# EAGLE design murdock_conn_v4 (EAGLE 6.4)
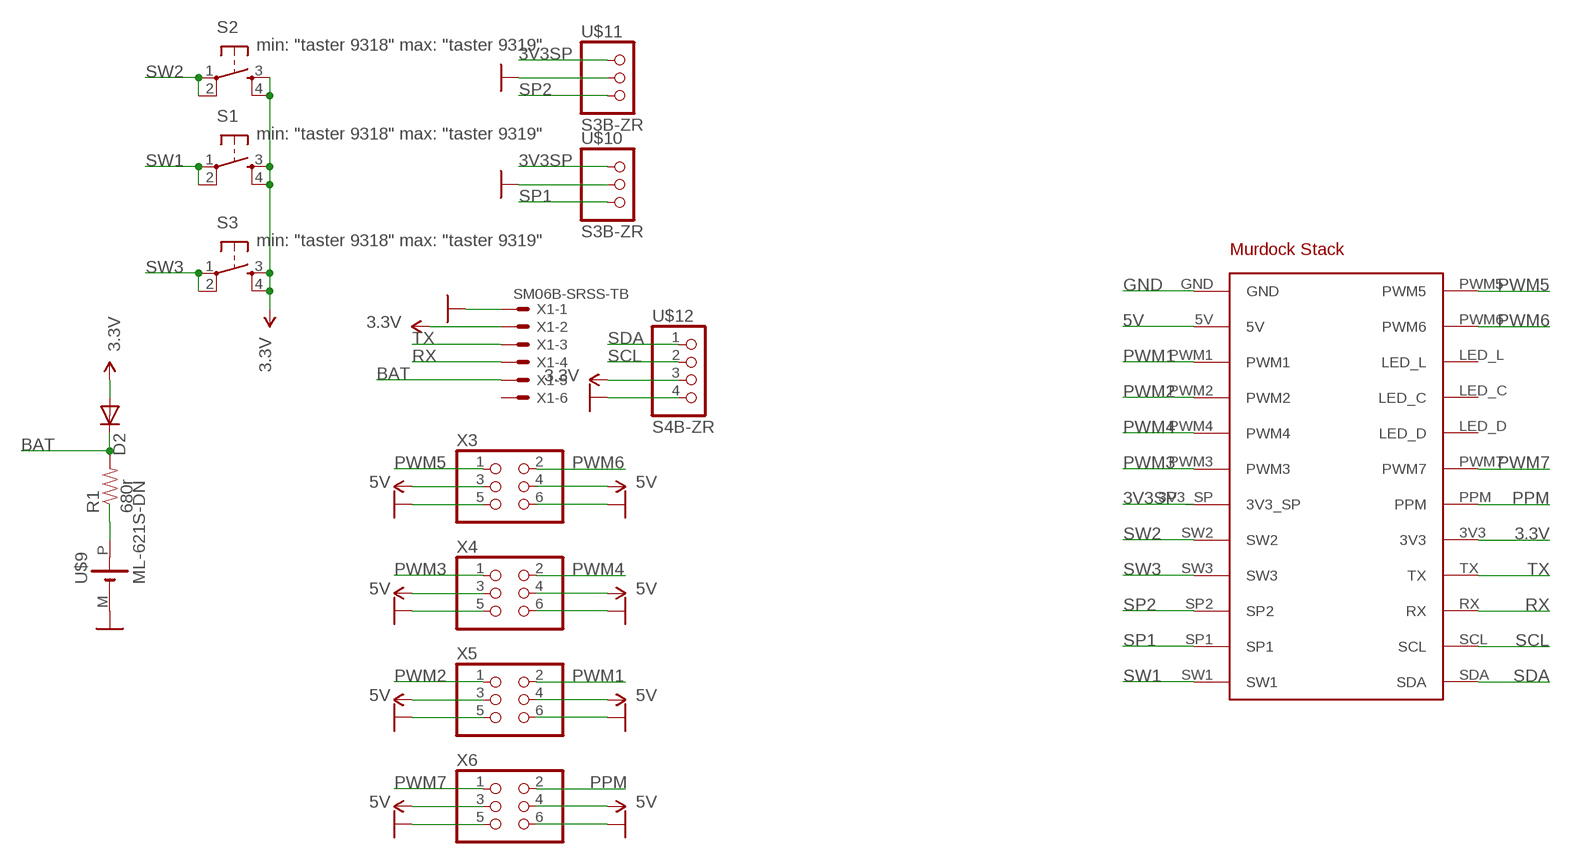
[diagram p0: schematic, sheet 1]

## Parts
D2  DIODE-SOD323-R  [SOD323-R]
R1  680r  RESISTOR0805-RES  [0805]
S1  min: "taster 9318" max: "taster 9319"  LSH  [LSH]
S2  min: "taster 9318" max: "taster 9319"  LSH  [LSH]
S3  min: "taster 9318" max: "taster 9319"  LSH  [LSH]
U$9  ML-621S-DN  [ML-621S-DN]
U$10  S3B-ZR  [S3B-ZR]
U$11  S3B-ZR  [S3B-ZR]
U$12  S4B-ZR  [S4B-ZR]
X1  SM06B-SRSS-TB  [SM06B-SRSS-TB]
X3  PINHD-2X3/90  [2X03/90]
X4  PINHD-2X3/90  [2X03/90]
X5  PINHD-2X3/90  [2X03/90]
X6  PINHD-2X3/90  [2X03/90]
X7  MURDOCK_STACK  [MURDOCK_STACK]

## Nets
3.3V: D2.A S1.3 S1.4 S2.3 S2.4 S3.3 S3.4 U$12.3 X1.2 X7.3V3
3V3SP: U$10.1 U$11.1 X7.3V3_SP
5V: X3.3 X3.4 X4.3 X4.4 X5.3 X5.4 X6.3 X6.4 X7.5V
BAT: D2.C R1.2 X1.5
GND: U$9.M(-) U$10.2 U$11.2 U$12.4 X1.1 X3.5 X3.6 X4.5 X4.6 X5.5 X5.6 X6.5 X6.6 X7.GND
N$1: R1.1 U$9.P(+)
PPM: X6.2 X7.PPM
PWM1: X5.2 X7.PWM1
PWM2: X5.1 X7.PWM2
PWM3: X4.1 X7.PWM3
PWM4: X4.2 X7.PWM4
PWM5: X3.1 X7.PWM5
PWM6: X3.2 X7.PWM6
PWM7: X6.1 X7.PWM7
RX: X1.4 X7.RX
SCL: U$12.2 X7.SCL
SDA: U$12.1 X7.SDA
SP1: U$10.3 X7.SP1
SP2: U$11.3 X7.SP2
SW1: S1.1 S1.2 X7.SW1
SW2: S2.1 S2.2 X7.SW2
SW3: S3.1 S3.2 X7.SW3
TX: X1.3 X7.TX
Unconnected: X1.6 X7.LED_C X7.LED_D X7.LED_L

## Library data of the parts
D2 = diode:DIODE-: DIODE
R1 = SparkFun-Passives:RESISTOR: Resistor Basic schematic elements and footprints for 0603, 1206, and PTH resistors.
S1-S3 = switch-tact:LSH
U$9 = seb:ML-621S-DN
U$10 U$11 = seb:S3B-ZR
U$12 = seb:S4B-ZR
X1 = con-jst:?M06B-SRSS-TB: Disconnectable Crimp style connector, 1.0mm pitch 6 contacts
X3-X6 = pinhead:PINHD-2X3: PIN HEADER
X7 = murdock:MURDOCK_STACK

## Board
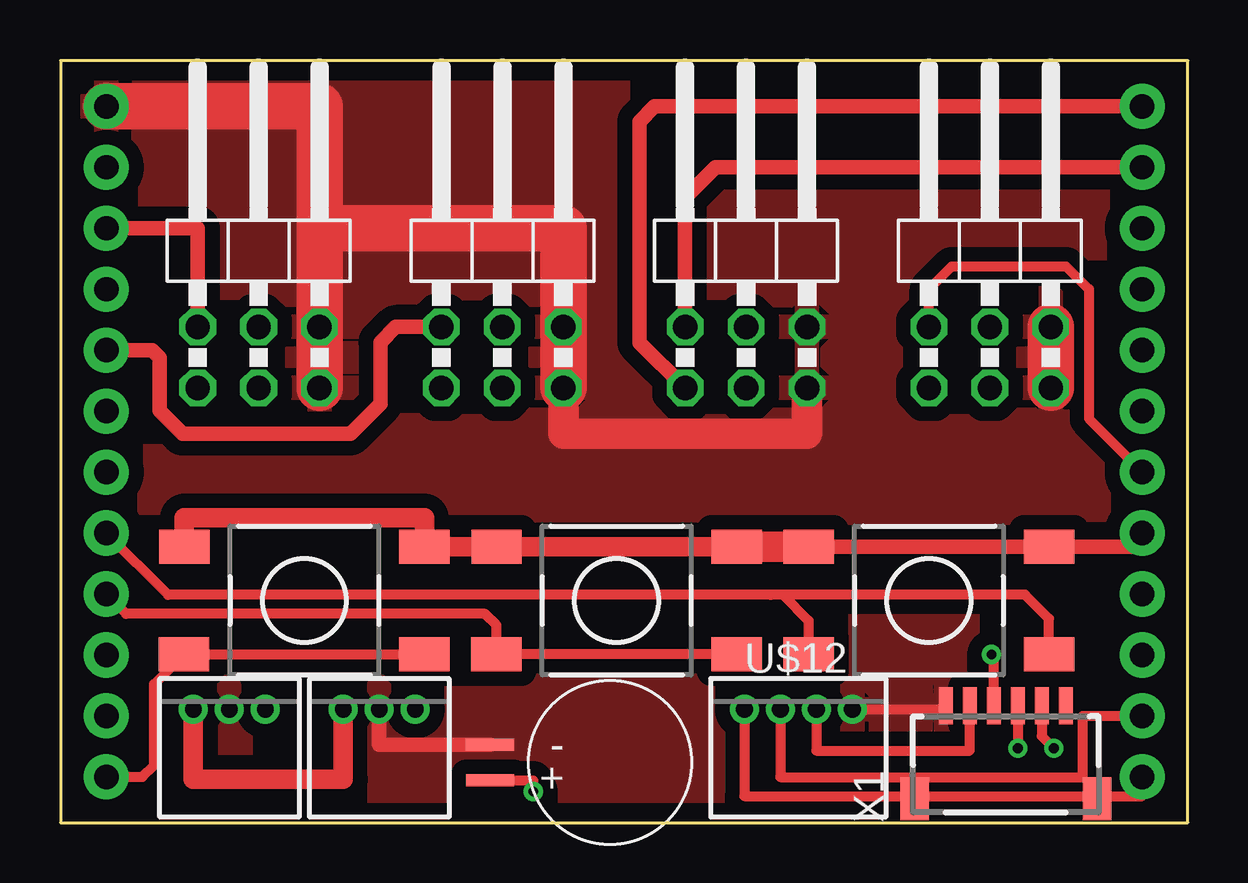
[diagram p1: board, top side]
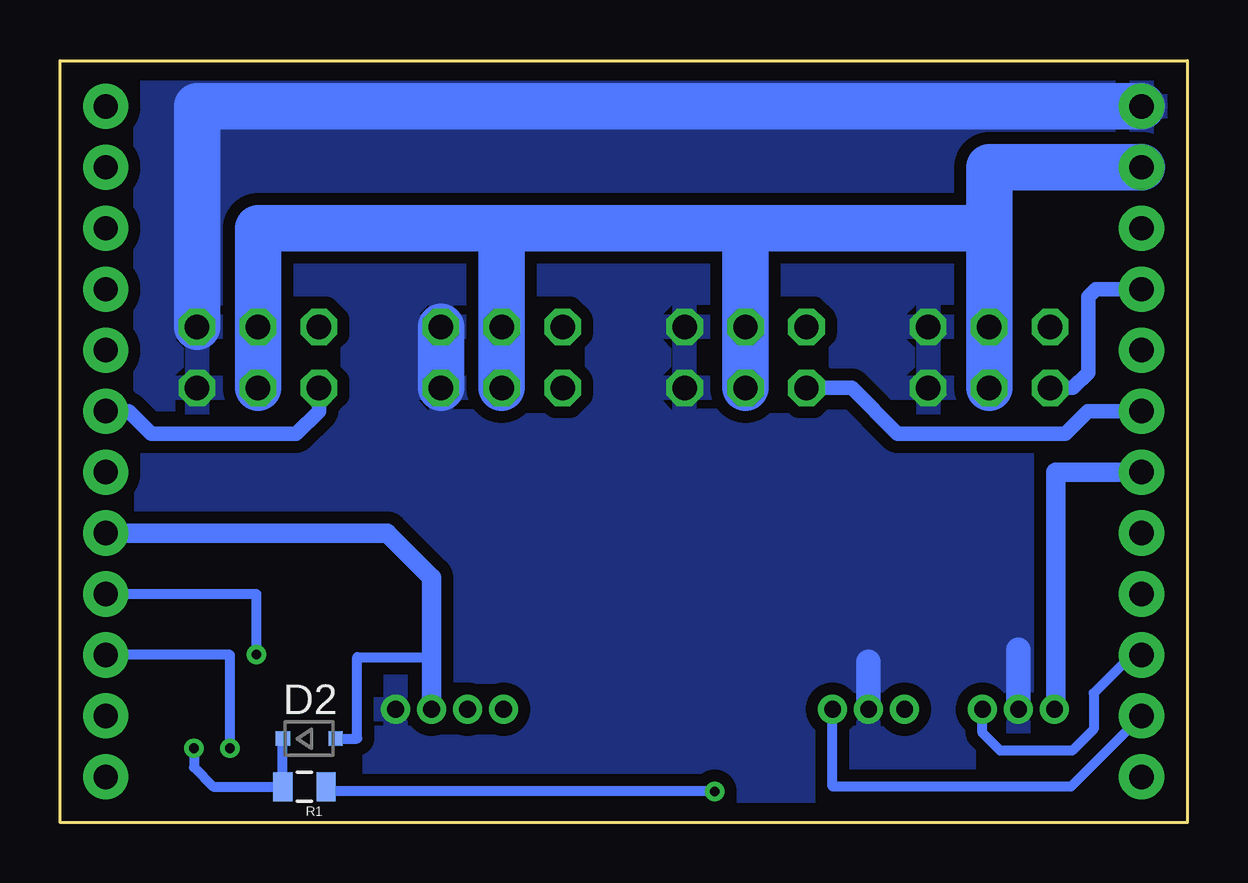
[diagram p2: board, bottom side, seen from below]

Size 46.99 x 31.75 mm. Coordinates in mm from the lower left corner, seen from the top.
Copper layers (1*16): Top 0.035mm / dielectric 1.5mm / Bottom 0.035mm
Design rules "default": minimum track width 10mil, minimum drill 0.4mm, track to track 8mil, track to pad 8mil, pad to pad 8mil, via to via 8mil, smd to smd 8mil, copper to edge 30mil, drill to drill 8mil, minimum pad ring 10mil, minimum via ring 8mil, stop-mask expansion 4mil, vias tented up to drill 1.5mm, thermal gap 10mil

### Footprints (pad centres in the part's own frame; a part is rotated, then mirrored left to right if it is on the bottom)
SOD323-R = smd 0.6 x 0.6: A 1.1,0; C -1.1,0
0805 = smd 0.8 x 1.2: 1 -0.9,0; 2 0.9,0
LSH = smd 2.1 x 1.4: 1 -5.005,2.24; 2 5.015,2.24; 3 -5.005,-2.24; 4 5.005,-2.24
ML-621S-DN = smd 2 x 0.5: M 0,-0.74; P 0,0.74
S3B-ZR = drill 0.7 pad 1.1: 1 -1.5,0; 2 0,0; 3 1.5,0
S4B-ZR = drill 0.7 pad 1.1: 1 -4.5,0; 2 -3,0; 3 -1.5,0; 4 0,0
SM06B-SRSS-TB = smd 0.6 x 1.55: 1 -2.5,2.975; 2 -1.5,2.975; 3 -0.5,2.975; 4 0.5,2.975; 5 1.5,2.975; 6 2.5,2.975 | smd 1.2 x 1.8: FIT@1 -3.8,-0.9; FIT@2 3.8,-0.9
2X03/90 = drill 1.016 octagon: 1 -2.54,-6.35; 2 -2.54,-3.81; 3 0,-6.35; 4 0,-3.81; 5 2.54,-6.35; 6 2.54,-3.81
MURDOCK_STACK = drill 1.016 pad 1.88: 3V3 45.085,12.065; 3V3_SP 1.905,14.605; 5V 1.905,27.305; GND 1.905,29.845; LED_C 45.085,22.225; LED_D 45.085,19.685; LED_L 45.085,24.765; PPM 45.085,14.605; PWM1 1.905,24.765; PWM2 1.905,22.225; PWM3 1.905,17.145; PWM4 1.905,19.685; PWM5 45.085,29.845; PWM6 45.085,27.305; PWM7 45.085,17.145; RX 45.085,6.985; SCL 45.085,4.445; SDA 45.085,1.905; SP1 1.905,4.445; SP2 1.905,6.985; SW1 1.905,1.905; SW2 1.905,12.065; SW3 1.905,9.525; TX 45.085,9.525

### Placement (x,y rotation side)
D2  36.6,3.5 0 bottom
R1  36.8,1.5 180 bottom
S1  10.16,9.26 180 top
S2  36.2,9.26 180 top
S3  23.18,9.26 180 top
U$9  17.9,2.5 180 top
U$10  13.29,4.73 0 top
U$11  7.04,4.73 0 top
U$12  33,4.73 0 top
X1  39.4,1.9 0 top
X3  28.57,24.46 0 top
X4  18.41,24.46 0 top
X5  8.26,24.46 0 top
X6  38.73,24.46 0 top
X7  0,0 0 top

### Tracks (layer width: path | path; a pad name or v marks a point on that pad's centre or on a via)
3.3V
  Top 0.406: U$12.3 31.5,3 37.9,3 X1.2
  Top 0.61: S2.4 S2.3 45.09,11.49 X7.3V3
  Top 0.813: S1.4 5.16,12.7 15.16,12.7 S1.3 S3.4 S3.3
  Top 1.27: S3.3 S2.4
  Bottom 0.406: 31.5,6.9 34.6,6.9 34.6,3.5 D2.A
  Bottom 0.813: U$12.3 31.5,6.9 31.5,10.2 33.37,12.06 X7.3V3
3V3SP
  Top 0.813: U$11.1 5.54,1.8 11.79,1.8 U$10.1
  Bottom 0.813: X7.3V3_SP 5.49,14.61 5.49,4.78 U$11.1
5V
  Bottom 1.93: X5.3 X5.4 8.26,24.77 | 18.41,24.77 X4.4 X4.3 | 18.41,24.77 8.26,24.77 | 28.57,24.77 X3.4 X3.3 | 28.57,24.77 18.41,24.77 | 28.57,24.77 38.73,24.77 X6.4 X6.3 | X7.5V 8.26,27.3 8.26,24.77
BAT  (via drill 0.4)
  Top 0.406: X1.5 40.9,3.6 v41.4,3.1
  Bottom 0.406: v41.4,3.1 41.4,2.3 40.6,1.5 R1.2 D2.C
GND
  Top 0.406: U$12.4 36.9,4.73 X1.1
  Top 0.61: U$9.M 13.29,3.24 U$10.2
  Top 1.27: X4.5 20.95,16.19 31.11,16.19 X3.5
  Top 1.93: 10.79,24.77 X5.6 X5.5 | 10.79,24.77 20.95,24.77 X4.6 X4.5 | X6.6 X6.5 | 10.79,24.77 10.79,29.84 X7.GND
  Bottom 1.016: U$11.2 7.04,7.2 | U$10.2 13.29,6.7
  Bottom 1.93: X6.6 41.27,29.84 X7.GND | X3.6 X3.5
  pour Top (isolate 0.61): -0.64,32.38 -0.64,-0.64 47.31,-0.64 47.31,32.38
  pour Bottom (isolate 0.5): -0.64,32.38 -0.64,-0.64 47.31,-0.64 47.31,32.38
N$1  (via drill 0.4)
  Top 0.406: U$9.P 19.7,1.76 v19.7,1.3
  Bottom 0.406: v19.7,1.3 35.9,1.3 R1.1
PPM
  Top 0.406: X6.2 36.2,22.23 37.15,23.18 41.91,23.18 42.86,22.23 42.86,16.83 X7.PPM
PWM1
  Top 0.61: X7.PWM1 5.71,24.77 X5.2
PWM2
  Bottom 0.61: X5.1 4.76,18.11 4.13,18.75 4.13,21.91 3.81,22.23 X7.PWM2
PWM3
  Bottom 0.61: X4.1 13.99,18.11 12.08,16.21 5.08,16.21 4.14,17.14 X7.PWM3
PWM4
  Top 0.61: X4.2 13.97,20.66 13.34,20.02 13.34,17.46 12.08,16.21 5.08,16.21 4.13,17.16 4.13,19.37 3.81,19.68 X7.PWM4
PWM5
  Top 0.61: X3.1 24.13,20 24.13,29.21 24.77,29.84 X7.PWM5
PWM6
  Top 0.61: X3.2 26.04,26.04 27.3,27.3 X7.PWM6
PWM7
  Bottom 0.61: X6.1 36.2,17.14 37.15,16.19 43.18,16.19 44.13,17.14 X7.PWM7
RX  (via drill 0.4)
  Top 0.406: X1.4 v39.9,3.1
  Bottom 0.406: v39.9,3.1 39.9,6.99 X7.RX
SCL
  Top 0.406: U$12.2 30,1.9 42.6,1.9 42.6,4.45 X7.SCL
SDA
  Top 0.406: U$12.1 28.5,1.1 45.09,1.1 X7.SDA
SP1
  Bottom 0.406: X7.SP1 4.85,1.5 14.79,1.5 U$10.3
SP2
  Bottom 0.406: X7.SP2 1.99,6.9 2.4,6.9 3.9,5.4 3.9,3.9 4.8,3 7.8,3 8.54,3.73 U$11.3
SW1
  Top 0.406: X7.SW1 3.4,1.91 3.9,2.4 3.9,5.77 S1.2 S1.1
SW2
  Top 0.406: 31.18,7.24 S2.2 31.18,8.42 30.11,9.49 29.6,9.49 | 29.6,9.49 4.48,9.49 X7.SW2 | S2.1 41.2,8.5 40.2,9.5 29.61,9.5 29.6,9.49
SW3
  Top 0.406: S3.1 S3.2 18.16,8.24 17.7,8.7 2.73,8.7 X7.SW3
TX  (via drill 0.4)
  Top 0.406: X1.3 38.9,7 v38.8,7
  Bottom 0.406: v38.8,7 38.8,9.53 X7.TX